# EAGLE schematic LEDDimmerLM3406 (EAGLE 6.4)
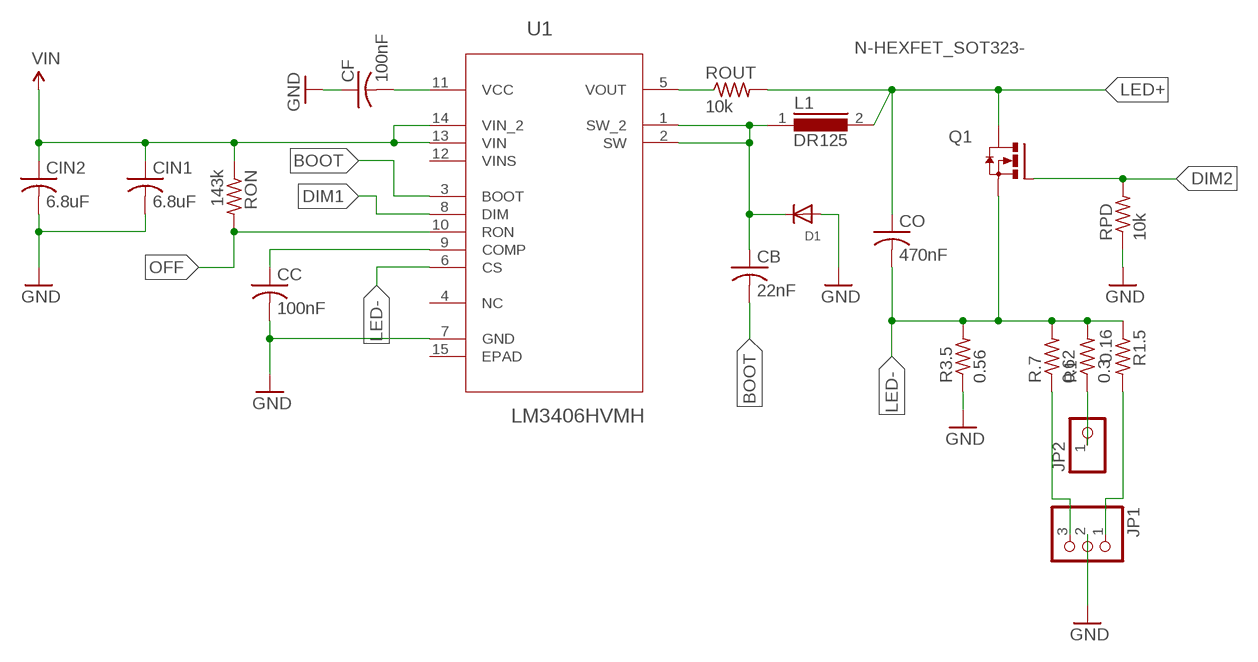
[diagram p0: schematic, sheet 1]

## Parts
CB  22nF  C-USC0603  [C0603]
CC  100nF  C-USC0603  [C0603]
CF  100nF  C-USC0603  [C0603]
CIN1  6.8uF  C-USC1812  [C1812]
CIN2  6.8uF  C-USC1812  [C1812]
CO  470nF  C-USC1206  [C1206]
D1  DIODESMA  [SMADIODE]
JP1  PINHD-1X3  [1X03]
JP2  PINHD-1X1  [1X01]
L1  DR125  [DR125]
Q1  N-HEXFET_SOT323-  [SOT223]
R1  0.3  R-US_R0805  [R0805]
R1.5  0.16  R-US_R0805  [R0805]
R3.5  0.56  R-US_R0805  [R0805]
R.7  0.62  R-US_R0805  [R0805]
RON  143k  R-US_R0805  [R0805]
ROUT  10k  R-US_R0603  [R0603]
RPD  10k  R-US_R0603  [R0603]
U1  LM3406HVMH  [SOP65P640X110-15N]

## Nets
BOOT: CB.2 U1.3(BOOT)
DIM1: U1.8(DIM)
DIM2: Q1.1(G) RPD.2
GND: CC.2 CF.1 CIN1.2 CIN2.2 D1.A JP1.2 R3.5.1 RPD.1 U1.7(GND)
LED+: CO.1 L1.2 Q1.4(D) ROUT.2
LED-: CO.2 Q1.3(S) R1.2 R1.5.1 R3.5.2 R.7.2 U1.6(CS)
N$1: CC.1 U1.9(COMP)
N$2: CF.2 U1.11(VCC)
N$3: CB.1 D1.C L1.1 U1.1(SW_2) U1.2(SW)
N$5: U1.5(VOUT)
N$7: JP1.3 R.7.1
N$8: JP1.1 R1.5.2
N$9: JP2.1 R1.1
OFF: RON.2 U1.10(RON)
VIN: CIN1.1 CIN2.1 RON.1 U1.13(VIN) U1.14(VIN_2)
Unconnected: ROUT.1 U1.4(NC) U1.12(VINS) U1.15(EPAD)

## Library data of the parts
CB CC CF CIN1 CIN2 CO = adafruit:C-US: CAPACITOR, American symbol
D1 = adafruit:DIODE: Diode SMADIODE - SMA Surface Mount Package 20V 1A Schottky Diode Digikey: 641-1014-6-ND DO-1N4148 - Through Hole Small Current Diode SOD-123 20V 1 A (.5mV Vf) Schottky Diode - Digikey: MBRX120TPMSCT-ND SOD-323 10V 570mA (.38mV Vf, 3ns) Schottky Diode - Digikey: ZLLS410CT-ND SOD-523 30V 30mA Schottky Diode (RB751S-40TE61) - Digikey: RB751S-40TE61CT-ND SOT23-R/W - SOT23 Package (R = Solder Paste/Reflow Ovens, W = Hand-Soldering) BAT54Film 40V 300mA - Digikey: 497-7162-1-ND
JP1 = adafruit:PINHD-1X3: PIN HEADER
JP2 = adafruit:PINHD-1X1: Pin header 1x1 for 0.1" spacing With round pins
L1 = inductors:DR125: High Power Density, High Efficiency, Shielded Inductors Source: coiltronics_dr_series.pdf
Q1 = transistor-power:N-HEXFET_?-*: HEXFET® Power MOSFET
R1 R1.5 R3.5 R.7 RON ROUT RPD = adafruit:R-US_: RESISTOR, American symbol
U1 = LM3406:LM3406HVMH: Constant Current Buck Regulator; MPN: LM3406HVMH; OC_FARNELL: 1685410; OC_NEWARK: 08P3934; PACKAGE: TSSOP-14; SUPPLIER: National Semiconductor